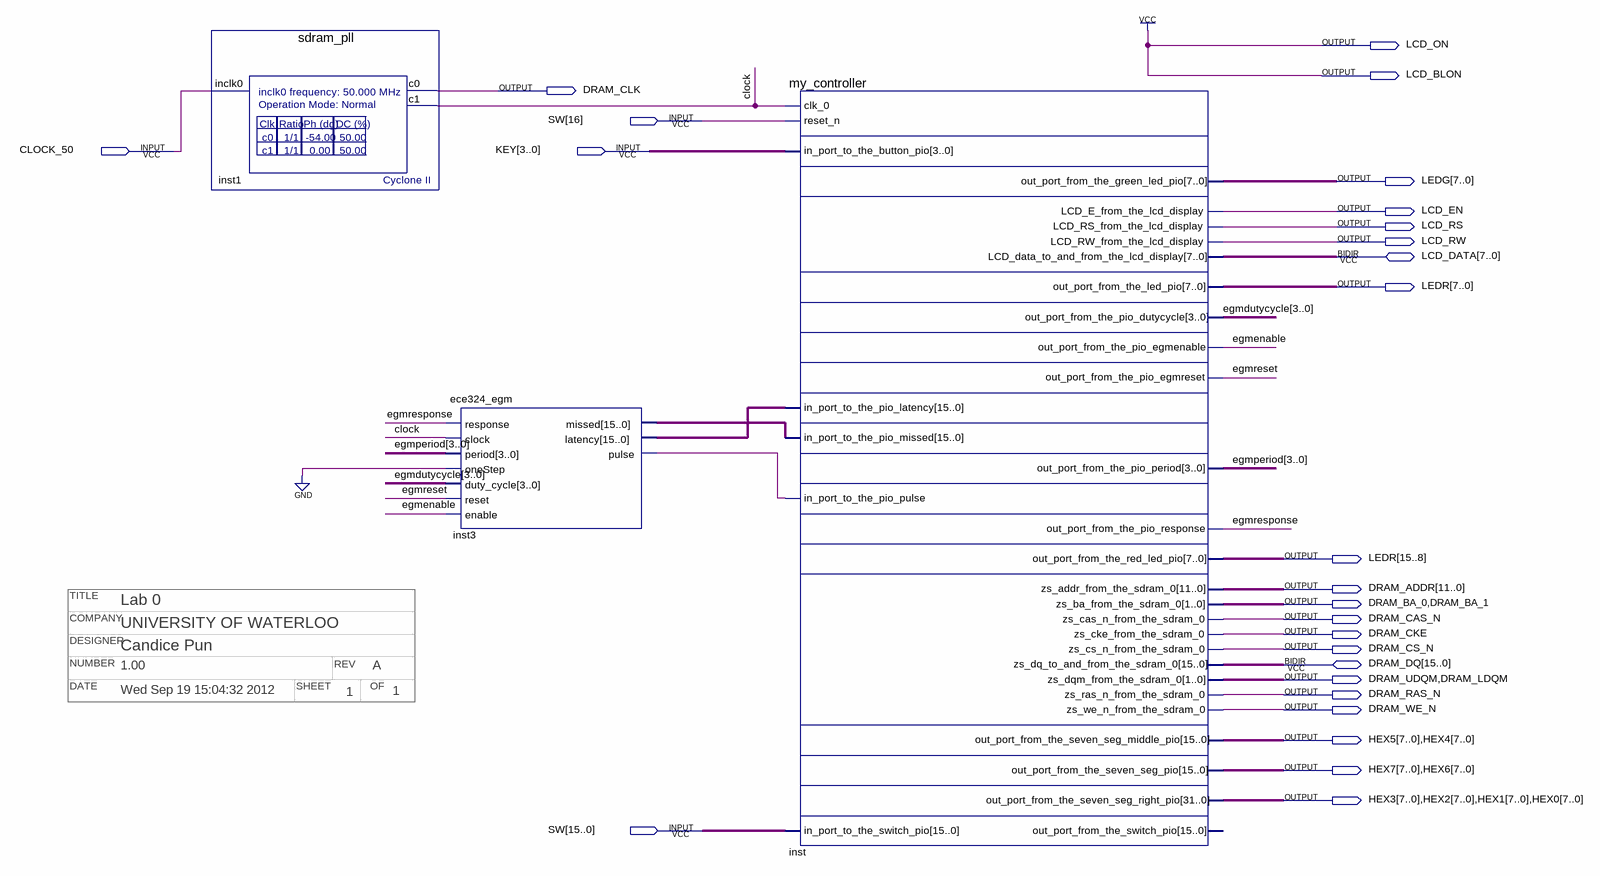
[diagram p0: schematic sheet]
// Quartus schematic myESystem.bdf as structural Verilog: 3 symbols, 26 pins
// Title block: COMPANY: UNIVERSITY OF WATERLOO; DATE: Wed Sep 19 15:04:32 2012; DESIGNER: Candice Pun; NUMBER: 1.00; OF: 1; REV: A; SHEET: 1; TITLE: Lab 0
module myESystem (
  input  [16:0] SW,
  input  CLOCK_50,
  input  [3:0] KEY,
  inout  [7:0] LCD_DATA,
  inout  [15:0] DRAM_DQ,
  output LCD_ON,
  output LCD_BLON,
  output DRAM_CLK,
  output [7:0] LEDG,
  output LCD_EN,
  output LCD_RS,
  output LCD_RW,
  output [15:0] LEDR,
  output [11:0] DRAM_ADDR,
  output DRAM_BA_0,
  output DRAM_BA_1,
  output DRAM_CAS_N,
  output DRAM_CKE,
  output DRAM_CS_N,
  output DRAM_UDQM,
  output DRAM_LDQM,
  output DRAM_RAS_N,
  output DRAM_WE_N,
  output [7:0] HEX5,
  output [7:0] HEX4,
  output [7:0] HEX7,
  output [7:0] HEX6,
  output [7:0] HEX3,
  output [7:0] HEX2,
  output [7:0] HEX1,
  output [7:0] HEX0
);

  wire clock, egmenable, egmreset, egmresponse, inst3_pulse;
  wire [3:0] egmdutycycle, egmperiod;
  wire [15:0] inst3_latency, inst3_missed;

  sdram_pll inst1 (.inclk0(CLOCK_50), .c0(DRAM_CLK), .c1(clock));
  ece324_egm inst3 (
    .response(egmresponse), .clock(clock), .period(egmperiod), .oneStep(1'b0), .duty_cycle(egmdutycycle),
    .reset(egmreset), .enable(egmenable), .missed(inst3_missed), .latency(inst3_latency), .pulse(inst3_pulse));
  my_controller inst (
    .clk_0(clock), .reset_n(SW[16]), .in_port_to_the_button_pio(KEY),
    .in_port_to_the_pio_latency(inst3_latency), .in_port_to_the_pio_missed(inst3_missed),
    .in_port_to_the_pio_pulse(inst3_pulse), .in_port_to_the_switch_pio(SW[15:0]),
    .out_port_from_the_green_led_pio(LEDG), .LCD_E_from_the_lcd_display(LCD_EN),
    .LCD_RS_from_the_lcd_display(LCD_RS), .LCD_RW_from_the_lcd_display(LCD_RW),
    .out_port_from_the_led_pio(LEDR[7:0]), .out_port_from_the_pio_dutycycle(egmdutycycle),
    .out_port_from_the_pio_egmenable(egmenable), .out_port_from_the_pio_egmreset(egmreset),
    .out_port_from_the_pio_period(egmperiod), .out_port_from_the_pio_response(egmresponse),
    .out_port_from_the_red_led_pio(LEDR[15:8]), .zs_addr_from_the_sdram_0(DRAM_ADDR),
    .zs_ba_from_the_sdram_0({DRAM_BA_0, DRAM_BA_1}), .zs_cas_n_from_the_sdram_0(DRAM_CAS_N),
    .zs_cke_from_the_sdram_0(DRAM_CKE), .zs_cs_n_from_the_sdram_0(DRAM_CS_N),
    .zs_dqm_from_the_sdram_0({DRAM_UDQM, DRAM_LDQM}), .zs_ras_n_from_the_sdram_0(DRAM_RAS_N),
    .zs_we_n_from_the_sdram_0(DRAM_WE_N), .out_port_from_the_seven_seg_middle_pio({HEX5, HEX4}),
    .out_port_from_the_seven_seg_pio({HEX7, HEX6}),
    .out_port_from_the_seven_seg_right_pio({HEX3, HEX2, HEX1, HEX0}),
    .LCD_data_to_and_from_the_lcd_display(LCD_DATA), .zs_dq_to_and_from_the_sdram_0(DRAM_DQ));  // open: out_port_from_the_switch_pio

  assign LCD_BLON = 1'b1;
  assign LCD_ON = 1'b1;
endmodule
